# Altium schematic sheet Schematics_2000W.SchDoc
size A4; SheetNumber: 1; SheetTotal: 1; SPICEModelCacheILTZOTXN: <root> / <DocumentId>ILTZOTXN</DocumentId> / <CacheFrame Number="0"> / <Model Name="transil" Kind="CKT"> / <Text>* File     : P6KE.LIB / * Revision : 1.0 / * Date     : June 2011 / * / *************************************************************************************** / * Information included is believed to be accurate and reliable. However, * / * ST Microelectronics assumes no responsibility for the consequences of  * / * use of such information nor for any infringement of patents or other   * / * rights of third parties which may result from its use. No license is   * / * granted by implication or otherwise under any patent patent rights of  * / * ST Microelectronics. Specification mentionned in this publication are  * / * subject to change without notice. This publication superseedes and 	 * / * replaces all information previously supplied. ST Microelectronics      * / * products are not authorized for use as critical components in life     * / * support or systems without express written approval of ST              * / * Microelectronics.                          	                         * / *                                                                    	 *			* / *    (c) 1997 ST Microelectronics. All rights reserved.     	         * / *                                                                    	 *			* / *           ST Microelectronics GROUP OF COMPANIES                       * / * Australia - Brazil - France - Germany - Hong Kong - Italy - Japan  	 * / * Korea - Malaysia - Malta - Morocco - The Netherlands - Singapore   	 * / * Spain - Sweden - Switzerland - Taiwan - United Kingdom - U.S.A.    	 * / *									 * / *************************************************************************************** / * / * UNIDIRECTIONAL TRANSIL / *$ / .SUBCKT TRANSIL  Anode  Cathode  PARAMS: / + IRM=1u VBRnom=12  VBRmax=13  IR=1m / + VCLmax=20  Ipp=100  Cjof=1n / + ISF=1f  NF=1  RSF=1m  IKFF=1000 / * IRM		Stand-off current at VRM / * VBR		Breakdown voltage / * IR		Reverse current at VBR / * VCL		Clamping voltage / * Ipp		Surge current / * Cjo		junction capacitance at 0V / * IS		Saturation current / * N		Emission coefficient / * RS		Serie résistance / * IKF		High injection knee current / Drev    A_int    Cathode    TRANSR / Dfwd   Anode   Cathode    TRANSF / Dr       A_int    Anode       DTRANS / ***** REVERSE BEHAVIOUR ***** / .MODEL  TRANSR  D( / + IS={IRM/2}   RS={(VCLmax-VBRmax)/Ipp} / + BV={VBRnom}  IBV={IR} / + IKF=1000  Cjo=1p  M=.3333  VJ=.6 / + ISR=1n  TT=1u ) / ****************** FORWARD BEHAVIOUR ****************** / ***** JUNCTION CAPACITANCE BEHAVIOUR Cj(VR) ***** / .MODEL   TRANSF  D( / + IS={ISF}  N={NF}  RS={RSF}  IKF={IKFF} / + Cjo={Cjof}  M=.3333  VJ=0.6  ISR=1.000E-21 / + BV=1000  IBV=1n  TT=1u ) / .MODEL   DTRANS  D( / + IS=1n  N=.01  RS=1u  IKF=1000  Cjo=1p / + M=.3333  VJ=.6  ISR=1n  BV=1000  IBV=1u / + TT=1u ) / .ENDS</Text> / </Model> / <Model Name="p6ke6v8a" Kind="CKT"> / <Text>************************************************************************************************* / *				P6KE FAMILY					* / ************************************************************************************************* / *$ / .SUBCKT  P6KE6V8A  Anode  Cathode / X1  Anode  Cathode  TRANSIL  PARAMS: / + IRM=1m  VBRnom=6.8  VBRmax=7.14 / + IR=10m  VCLmax=13.4  Ipp=298  Cjof=4000p / + ISF=27.04f   NF=1.016  RSF=13.69m   IKFF=41.7 / .ENDS</Text> / <Dependency>0\transil</Dependency> / </Model> / <Model Name="1n5822rl" Kind="MDL"> / <Text>******************************************************************* / * Model name       : 1N5822RL / * Description      : Low Drop Power Schottky Diode / * Package type     : DO-201AD / ******************************************************************* / .MODEL 1N5822RL D IS=2.5069E-6 N=1.0281 RS=11.149E-3 IKF=403.32 CJO=980.33E-12 / + M=.47978 VJ=.3905 ISR=5.2260E-6 NR=4.9950 EG=.69 XTI=2 TT=0 FC=0.5</Text> / </Model> / <Model Name="irf1407" Kind="CKT"> / <Text>.SUBCKT irf1407 1 2 3 / ************************************** / *      Model Generated by MODPEX     * / *Copyright(c) Symmetry Design Systems* / *         All Rights Reserved        * / *    UNPUBLISHED LICENSED SOFTWARE   * / *   Contains Proprietary Information * / *      Which is The Property of      * / *     SYMMETRY OR ITS LICENSORS      * / *Commercial Use or Resale Restricted * / *   by Symmetry License Agreement    * / ************************************** / * Model generated on Jan 15, 03 / * MODEL FORMAT: SPICE3 / * Symmetry POWER MOS Model (Version 1.0) / * External Node Designations / * Node 1 -&gt; Drain / * Node 2 -&gt; Gate / * Node 3 -&gt; Source / M1 9 7 8 8 MM L=100u W=100u / .MODEL MM NMOS LEVEL=1 IS=1e-32 / +VTO=3.91946 LAMBDA=0 KP=331.363 / +CGSO=5.53647e-05 CGDO=1e-11 / RS 8 3 0.00443748 / D1 3 1 MD / .MODEL MD D IS=1.96051e-09 RS=0.00257891 N=1.34027 BV=75 / +IBV=0.00025 EG=1.2 XTI=2.26834 TT=0.0001 / +CJO=3.026e-09 VJ=4.99086 M=0.799307 FC=0.5 / RDS 3 1 1e+06 / RD 9 1 0.00208794 / RG 2 7 4.94006 / D2 4 5 MD1 / * Default values used in MD1: / *   RS=0 EG=1.11 XTI=3.0 TT=0 / *   BV=infinite IBV=1mA / .MODEL MD1 D IS=1e-32 N=50 / +CJO=7.6815e-09 VJ=0.5 M=0.9 FC=1e-08 / D3 0 5 MD2 / * Default values used in MD2: / *   EG=1.11 XTI=3.0 TT=0 CJO=0 / *   BV=infinite IBV=1mA / .MODEL MD2 D IS=1e-10 N=0.4 RS=3e-06 / RL 5 10 1 / FI2 7 9 VFI2 -1 / VFI2 4 0 0 / EV16 10 0 9 7 1 / CAP 11 10 9.06553e-09 / FI1 7 9 VFI1 -1 / VFI1 11 6 0 / RCAP 6 10 1 / D4 0 6 MD3 / * Default values used in MD3: / *   EG=1.11 XTI=3.0 TT=0 CJO=0 / *   RS=0 BV=infinite IBV=1mA / .MODEL MD3 D IS=1e-10 N=0.4 / .ENDS irf1407</Text> / </Model> / </CacheFrame> / </root>
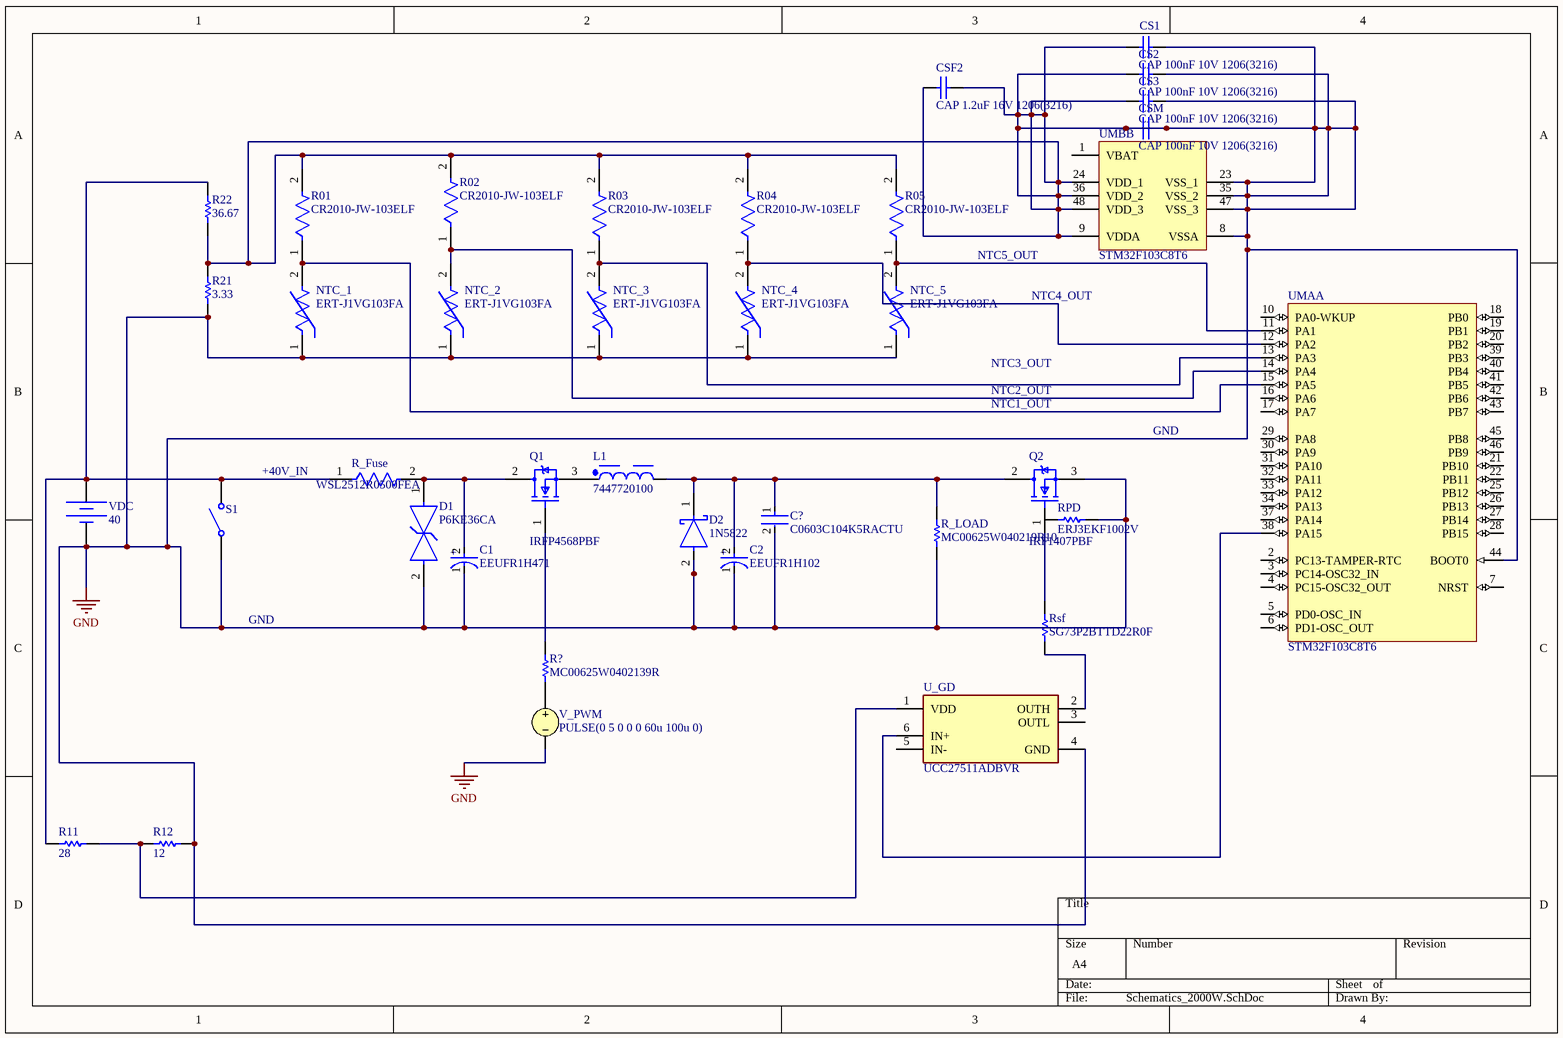
[diagram p0: Schematics_2000W.SchDoc]

## Parts
C1  EEUFR1H471  [FP-RAD-TH-D_12_5_0_5-L_20-MFG]
C2  EEUFR1H102  [FP-RAD-TH-D_16_0_5-L_25_2-MFG]
C?  C0603C104K5RACTU  [FP-C0603C-CF-MFG]
CS1  CAP 100nF 10V 1206(3216)  [CAPC1206(3216)100_M]
CS2  CAP 100nF 10V 1206(3216)  [CAPC1206(3216)100_M]
CS3  CAP 100nF 10V 1206(3216)  [CAPC1206(3216)100_M]
CSF2  CAP 1.2uF 16V 1206(3216)  [CAPC1206(3216)110_N]
CSM  CAP 100nF 10V 1206(3216)  [CAPC1206(3216)100_M]
D1  P6KE36CA  [FP-17-02-CA-MFG]
D2  1N5822  [FP-DO-201AD-MFG]
L1  7447720100  [WE-TI_8095]
NTC_1  ERT-J1VG103FA  [FP-ERTJ1-MFG]
NTC_2  ERT-J1VG103FA  [FP-ERTJ1-MFG]
NTC_3  ERT-J1VG103FA  [FP-ERTJ1-MFG]
NTC_4  ERT-J1VG103FA  [FP-ERTJ1-MFG]
NTC_5  ERT-J1VG103FA  [FP-ERTJ1-MFG]
Q1  IRFP4568PBF  [FP-PG-TO247-3-MFG]
Q2  IRF1407PBF  [FP-PG-TO220-3-MFG]
R01  CR2010-JW-103ELF  [FP-CR2010-IPC_C]
R02  CR2010-JW-103ELF  [FP-CR2010-IPC_C]
R03  CR2010-JW-103ELF  [FP-CR2010-IPC_C]
R04  CR2010-JW-103ELF  [FP-CR2010-IPC_C]
R05  CR2010-JW-103ELF  [FP-CR2010-IPC_C]
R11  value 28  (hidden comment: Resistor)
R12  value 12  (hidden comment: Resistor)
R21  value 3.33  (hidden comment: Resistor)
R22  value 36.67  (hidden comment: Resistor)
R?  MC00625W0402139R  [RESC1005X40X25ML10T10]
R_Fuse  WSL2512R0500FEA  [FP-WSL2512-MFG]
R_LOAD  MC00625W040219R10  [RESC1005X40X25NL10T10]
RPD  ERJ3EKF1002V  [RESC1609X55X30LL15T15]
Rsf  SG73P2BTTD22R0F  [RESC3216X70X40NL20T20]
S1  Single-Pole, Single-Throw Switch  (value not drawn)
U_GD  UCC27511ADBVR  [FP-DBV0006A-IPC_B]
UMA  STM32F103C8T6  [STM-LQFP48_L]  (part A of 2)
UMB  STM32F103C8T6  [STM-LQFP48_L]  (part B of 2)
V_PWM  PULSE(0 5 0 0 0 60u 100u 0)
VDC  DC Magnitude: 40  (hidden comment: Constant Voltage Source)

## Nets
GND: C1.1(C) C2.1(C) C?.2 CS1.1 CS1.2 CS2.1 CS2.2 CS3.1 CS3.2 CSF2.1 CSF2.2 CSM.1 CSM.2 D1.2 D2.2(A) NTC_1.1 NTC_2.1 NTC_3.1 NTC_4.1 NTC_5.1 Q2.3(S) R01.2 R02.2 R03.2 R04.2 R05.2 R12.2 R21.1 R21.2 R22.1 R_LOAD.1 RPD.2 S1.1 U_GD.4(GND) UMA.44(BOOT0) UMB.8(VSSA) UMB.9(VDDA) UMB.23(VSS_1) UMB.24(VDD_1) UMB.35(VSS_2) UMB.36(VDD_2) UMB.47(VSS_3) UMB.48(VDD_3) V_PWM.2 VDC.2
NetC1_2: C1.2(A) D1.1 Q1.2(D) R_Fuse.2
NetC2_2: C2.2(A) C?.1 D2.1(C) L1.2 Q2.2(D) R_LOAD.2
NetL1_1: L1.1 Q1.3(S)
NetNTC_1_2: NTC_1.2 R01.1 UMA.15(PA5)
NetNTC_2_2: NTC_2.2 R02.1 UMA.14(PA4)
NetNTC_3_2: NTC_3.2 R03.1 UMA.13(PA3)
NetNTC_4_2: NTC_4.2 R04.1 UMA.12(PA2)
NetNTC_5_2: NTC_5.2 R05.1 UMA.11(PA1)
NetQ1_1: Q1.1(G) R?.2
NetQ2_1: Q2.1(G) Rsf.2
NetR11_1: R11.1 R22.2 R_Fuse.1 S1.2 VDC.1
NetR11_2: R11.2 R12.1 U_GD.1(VDD)
NetR?_1: R?.1 V_PWM.1
NetRsf_1: Rsf.1 U_GD.2(OUTH)
NetU_GD_6: U_GD.6(IN+) UMA.38(PA15)

Not connected (* = marked no-connect by the designer): RPD 1; U_GD 3(OUTL) 5(IN-); UMA 2(PC13-TAMPER-RTC) 3(PC14-OSC32_IN) 4(PC15-OSC32_OUT) 5(PD0-OSC_IN) 6(PD1-OSC_OUT) 7(NRST) 10(PA0-WKUP) 16(PA6) 17(PA7) 18(PB0) 19(PB1) 20(PB2) 21(PB10) 22(PB11) 25(PB12) 26(PB13) 27(PB14) 28(PB15) 29(PA8) 30(PA9) 31(PA10) 32(PA11) 33(PA12) 34(PA13) 37(PA14) 39(PB3) 40(PB4) 41(PB5) 42(PB6) 43(PB7) 45(PB8) 46(PB9); UMB 1(VBAT)

## Notes on the sheet
- NTC5_OUT
- NTC4_OUT
- NTC3_OUT
- NTC2_OUT
- NTC1_OUT
- GND
- +40V_IN
- (in symbol CMP-05427-000625-1) +
- (in symbol CMP-05427-001062-1) +

## Library data of the parts
C1 = CMP-05427-001062-1: Aluminum Electrolytic Capacitors (Radial Lead Type) 470uF ±20% 50V; Ripple Current: 2.26A; Lead/Base Style: Straight; Lead Diameter: 0.6mm; Life (Hours): 10000Hour; Impedance: 22mR; Voltage Rating: 50V; RoHS Compliant: Yes; Max Operating Temperature: 105°C; Length: 20mm; Packaging: Bulk; Capacitance: 470uF; Height: 20mm; Ripple Current (AC): 2.26A; Lead Pitch: 5mm; Voltage: 50V; Termination: Radial; Tolerance: 20%; Lead Free: Lead Free; Case/Package: Radial; Series: FR; Features: General Purpose; Mount: Through Hole; Height - Seated (Max): 0.787inch; Construction: RADIAL; Package Quantity: 200; Number of Pins: 2; ESR (Equivalent Series Resistance): 22mR; Voltage Rating (DC): 50V; Radiation Hardening: No; Diameter: 12.5mm; Min Operating Temperature: -40°C; Value: 470uF
C2 = CMP-05427-000625-1: Aluminum Electrolytic Capacitors (Radial Lead Type) 1000uF ±20% 50V; Polarity: Polar; ESR (Equivalent Series Resistance): 16mR; Ripple Current: 3.32A; Life (Hours): 10000Hour; Lead Diameter: 0.8mm; Dielectric Material: Aluminium; Lead/Base Style: Straight; Capacitance: 1mF; Value: 1mF; RoHS Compliant: Yes; Mount: Through Hole; Voltage Rating: 50V; Lead Free: Lead Free; Packaging: Bulk; Min Operating Temperature: -40°C; Package Quantity: 100; Max Operating Temperature: 105°C; Radiation Hardening: No; Termination: Radial; Construction: RADIAL; Height: 25mm; Length: 25mm; Tolerance: 20%; Number of Pins: 2; Ripple Current (AC): 3.32A; Diameter: 16mm; Case/Package: Radial; Impedance: 16mR; Height - Seated (Max): 1.063inch; Voltage: 50V; Voltage Rating (DC): 50V; Series: FR; Lead Pitch: 7.5mm
C? = CMP-2006-03061-2: CAP CER 0.1UF 50V X7R 0603; Manufacturer: KEMET; Tolerance: 0.1; Description: C0603 0.10 μF X7R 30ppm/°C 10.00% 50 V; Temperature Coefficient: 30ppm/°C; Material: Ceramic; Automotive Grade: Grade 1; Value: 0.10 μF; Temperature: -55°C to +125°C; RoHS: TRUE; Temperature Range High: +125°C; Lead Free: Yes; Octopart: https://octopart.com/c0603c104k5ractu-kemet-139244; Digikey Description: CAP CER 0.1UF 50V X7R 0603; Category: Cap; Package: C0603C-CF; ComponentLink2Description: Datasheet; Temperature Range Low: -55°C; Device Class L1: Passive Components; Voltage Rating: 50 V; Automotive: Yes; Device Class L3: Ceramic Capacitors; ComponentLink2URL: https://api.kemet.com/component-edge/download/datasheet/C0603C100J5GACAUTO.pdf; Capacitance: 0.10 μF; Device Class L2: Capacitors; Manufacturer Part Number: C0603C104K5RACTU; Temperature Characteristic: X7R; Height: 0.87mm
CS1-CS3 CSM = CMP-1037-04172-1: CAP 100nF 10V ±5% 1206 (3216 Metric) Thickness 1mm SMD; Case-Metric: 3216; Case-EIA: 1206; Tolerance: Â±5%; Max Thickness: 1 mm; Rated Voltage: 10 V; Technology: SMT; Value: 100nF
CSF2 = CMP-1037-04737-1: CAP 1.2uF 16V ±10% 1206 (3216 Metric) Thickness 1.1mm SMD; Tolerance: Â±10%; Case-EIA: 1206; Case-Metric: 3216; Technology: SMT; Max Thickness: 1.1 mm; Rated Voltage: 16 V; Value: 1.2uF
D1 = CMP-00278-84409643-1: P6KE36CA Fairchild P6KE36CA, Bi-Directional TVS Diode, 600W, 2-Pin DO-15; Power Line Protection: No; Reverse Standoff Voltage: 30.8V; Leakage Current: 5µA; Peak Pulse Current: 12A; Max Breakdown Voltage: 37.8V; Number of Channels: 1; Capacitance: 1.6pF; Clamping Voltage: 49.9V; Polarity: Bidirectional; Voltage Rating (DC): 36V; Breakdown Voltage: 34.2V; Max Junction Temperature (Tj): 175°C; Element Configuration: Single; Test Current: 1mA; Max Power Dissipation: 600W; Lead Free: Lead Free; Radiation Hardening: No; Termination: Axial; Case/Package: Axial; Width: 3.56mm; Length: 7.62mm; Weight: 300mg; REACH SVHC: No SVHC; Max Reverse Leakage Current: 5µA; Power Rating: 600W; Direction: Bidirectional; Max Surge Current: 12A; Diameter: 3.56mm; Peak Pulse Power: 600W; Max Operating Temperature: 175°C; RoHS: Compliant; Mount: Through Hole; Number of Pins: 2; Number of Bidirectional Channels: 1; Min Breakdown Voltage: 34.2V; Reverse Breakdown Voltage: 34.2V; Composition: Zener; Number of Elements: 1; Min Operating Temperature: -55°C; Operating Supply Voltage: 30.8V; Height: 3.68mm; NexarPartId: 84409643
D2 = CMP-12187-000025-1: DIODE SCHOTTKY 40V 3A DO201AD; Manufacturer: STMicroelectronics; Max Junction Temp: +150°C; Peak Reverse Current: 2mA; Max Surge Forward Current: 80A; Temperature Range High: +150°C; Automotive: No; RoHS: TRUE; ComponentLink2Description: Datasheet; Manufacturer Part Number: 1N5822; Lead Free: Yes; Octopart: https://octopart.com/1n5822-stmicroelectronics-323225; Device Class L2: Diodes; Max Repetitive Reverse Voltage: 40V; Height: 5.3mm; Category: Diode; Digikey Description: DIODE SCHOTTKY 40V 3A DO201AD; ComponentLink2URL: https://www.st.com/resource/en/datasheet/1n5822.pdf; Device Class L3: Schottky Diodes; Device Class L1: Discrete Semiconductors; Forward Current: 3A; Mouser Description: Schottky Diodes & Rectifiers Vr/40V Io/3A BULK; Package: DO-201AD
L1 = CMP-03913-110288125-2: 7447720100 Inductor, 10Uh, Unshielded, 3.5A, Rad Rohs Compliant: Yes; Inductance: 10µH; DC Resistance (DCR): 30mΩ; Voltage Rating: 80V; NexarPartId: 110288125; Ambient Temperature Range Low: -40°C; Ambient Temperature Range High: 85°C; Width: 7.8mm; Height: 9.5mm; RoHS: Compliant; Length: 7.8mm; Min Operating Temperature: -40°C; Current Rating: 3.5A; Max Operating Temperature: 125°C
NTC_1-NTC_5 = CMP-05419-000001-1: THERMISTOR NTC 10KOHM 3380K 0603; Resistance: 10kR; Max Power Dissipation: 100mW; Resistance Tolerance: 1%; Case Code (Imperial): 0603; Height: 0.8mm; Case/Package: 0603; Depth: 0.8mm; Min Operating Temperature: -40°C; Accuracy: 1%; Series: ERT-J; Termination: SMD/SMT; Length: 1.6mm; Number of Pins: 2; Lead Free: Lead Free; Power Rating: 100mW; Package Quantity: 4000; RoHS Compliant: Yes; Max Operating Temperature: 125°C; Width: 800um; REACH SVHC: No SVHC; Packaging: Tape and Reel; Tolerance: 1%; Mount: Surface Mount; Case Code (Metric): 1608; Radiation Hardening: No
Q1 = CMP-32901-000093-1: MOSFET N-CH 150V 171A TO-247AC; Manufacturer: Infineon; Power Dissipation: 517W; Reverse Recovery Time: 110ns; Gate Charge At Vgs: 151nC @ 10V; Number Of Channels: 1; Pulse Drain Current: 684A; Standoff Height: 3.71mm; Turn On Delay Time: 27ns; Max Forward Diode Voltage: 1.3V; Turn Off Delay Time: 47ns; Depletion Mode: False; Threshold Vgs Max: 5V; Input Capacitace At Vds: 10470pF @ 50V; Reverse Recovery Charge: 515nC; Rthja Max: 40°C/W; Drain To Source Resistance: 4.8mΩ; Threshold Vgs Min: 3V; Max Junction Temp: +175°C; Gate To Source Voltage: 30V; Temperature: -55°C to +175°C; Device Class L1: Discrete Semiconductors; Octopart: https://octopart.com/irfp4568pbf-infineon-65874045; Manufacturer Part Number: IRFP4568PBF; Temperature Range Low: -55°C; Category: Trans; ComponentLink2URL: https://www.infineon.com/dgdl/irfp4568pbf.pdf?fileId=5546d462533600a40153562c7c32201b; ComponentLink2Description: Datasheet; Height: 24.99mm; Drain To Source Breakdown Voltage: 150V; Number Of N Channels: 1; Automotive: No; Lead Free: Yes; Device Class L3: MOSFETs; Package: PG-TO247-3; Drain To Source Voltage: 150V; Device Class L2: Transistors; Footprint Url: https://www.infineon.com/cms/en/product/packages/PG-TO247/PG-TO247-3-901/; Continuous Drain Current: 171A; Digikey Description: MOSFET N-CH 150V 171A TO-247AC; RoHS: TRUE; Temperature Range High: +175°C
Q2 = CMP-32901-000505-1: MOSFET N-CH 75V 130A TO-220AB; Rds On Max: 7.8mR; Element Configuration: Single; Max Power Dissipation: 330W; Turn-Off Delay Time: 150ns; Input Capacitance: 5.6nF; Gate to Source Voltage (Vgs): 20V; Turn-On Delay Time: 11ns; Threshold Voltage: 4V; Max Operating Temperature: 175°C; Height: 0.65inch; RoHS Compliant: Yes; Case/Package: TO-220; Lead Free: Lead Free; Max Dual Supply Voltage: 75V; Drain to Source Voltage (Vdss): 75V; Min Operating Temperature: -55°C; Halogen Free: Halogen Free; REACH SVHC: No SVHC; Length: 0.42inch; Power Dissipation: 330W; Drain to Source Resistance: 7.8mR; Packaging: Rail/Tube; Continuous Drain Current (ID): 130A; Number of Pins: 3; Width: 0.19inch; Drain to Source Breakdown Voltage: 75V; Mount: Through Hole
R01 R02 R03 R04 R05 = CMP-07231-003456-1: Thick Film Chip Resistors 2010 10kΩ 0.5W 5% 200ppm/°C; Resistance: 10kR; Voltage Rating: 200V; Power Rating: 500mW; Tolerance: 5%; Contact Plating: Tin; Length: 5mm; Case/Package: 2010; Package Quantity: 4000; Max Operating Temperature: 155°C; Case Code (Imperial): 2010; Mount: Surface Mount; Case Code (Metric): 5025; Width: 2.5mm; Temperature Coefficient: 200ppm/°C; Packaging: Tape and Reel; Height: 0.6mm; Radiation Hardening: No; Composition: Thick Film; Min Operating Temperature: -55°C; Termination: SMD/SMT
R11 R12 R21 R22 = Resistor: TC1: 0; SimulationGenericComponent: True; TC2: 0
R? = CMP-2002-06169-1: Manufacturer: Multicomp; Part Number: MC00625W0402139R
R_Fuse = CMP-2000-07420-2: RES 0.05 OHM 1% 1W 2512; Manufacturer: Vishay; 3DS Part Number: 110-00001; Resistance: 50mΩ; Temperature Coefficient: 75ppm/°C; Automotive Grade: Grade 0; Description: Power Metal Strip® Resistors, Low Value (down to 0.0005 ), Surface Mount; Value: 50mΩ; Automotive: Yes; Tolerance: 1%; Device Class L3: Chip SMD Resistors; Category: Res; Package: WSL2512; Lead Free: Yes; Octopart: https://octopart.com/wsl2512r0500fea-vishay-39744678; ComponentLink2URL: http://www.vishay.com/docs/30100/wsl.pdf; Height: 0.889mm; Composition: Metal Element; Temperature Range High: +170°C; ComponentLink2Description: Datasheet; Digikey Description: RES 0.05 OHM 1% 1W 2512; Series: WSL; Temperature: -65°C to +170°C; Temperature Range Low: -65°C; Manufacturer Part Number: WSL2512R0500FEA; Device Class L1: Passive Components; RoHS: TRUE; Power Rating: 1W; Ipc Land Pattern Name: RESC635318X64; Device Class L2: Resistors
R_LOAD = CMP-2002-06389-1: Manufacturer: Multicomp; Part Number: MC00625W040219R10
RPD = CMP-1012-00623-3: Chip Resistor, 10 KOhm, +/- 1%, 0.1 W, -55 to 155 degC, 0603 (1608 Metric), RoHS, Tape and Reel; Manufacturer: Panasonic; Voltage Rating: 75V; Case\/Package: 0603; Power Rating: 100mW; Resistance: 10KOhm; Temperature Coefficient: 100ppm\/degreesC; Value: 10KOhm; Number of Pins: 2; Package Reference: 603; Depth: 0.8mm; Mount: SurfaceMount; Package Description: 2-Pin Surface Mount Device, Body 1.6 x 0.85 mm; Datasheet Version: 02/2017; Length: 1.6mm; Lead Free: LeadFree; Height: 0.45mm; Number of Terminations: 2; Max Power Dissipation: 100mW; Min Operating Temperature: -55degC; Datasheet URL: https://industrial.panasonic.com/cdbs/www-data/pdf/RDA0000/AOA0000C304.pdf; Termination: SMD/SMT; Case Code (Metric): 1608; Case Code (Imperial): 0603; Tolerance: 1%; Max Operating Temperature: 155degC; RoHSCompliant: true; Voltage Rating (DC): 75V; Radiation Hardening: No; Packaging: TapeandReel; Composition: ThickFilm; Mounting Technology: SurfaceMount; Manufacturer URL: http://www.panasonic.com/; Width: 0.031inch; REACH SVHC: NoSVHC; Contact Plating: Tin; Military Standard: Not; Package Quantity: 1
Rsf = CMP-2003-01707-1: Manufacturer: KOA Speer; Part Number: SG73P2BTTD22R0F
S1 = SPST SW: closed: 0; Rclosed: 1m; Ropen: 1Meg; SimulationGenericComponent: True
U_GD = CMP-04912-000035-1: IC GATE DRVR LOW-SIDE SOT23-6; Number of Drivers: 1; Max Output Current: 8A; Channel Type: Single; Case/Package: SOT-23-6; Mount: Surface Mount; Max Operating Temperature: 140°C; Packaging: Tape and Reel; Min Operating Temperature: -40°C; RoHS Compliant: Yes; Number of Channels: 1
UMA UMB = CMP-0237-00215-3: ARM Cortex-M3 32-bit MCU, 64 KB Flash, 20 KB Internal RAM, 37 I/Os, 48-pin LQFP, -40 to 85 degC, Tray; Supply Voltage(Vcc) min (V): 2; Internal RAM Size (kB): 20; FLASH Size (Prog) (kB): 64; A/D Converter: 2x12-bit (10 Channel); I/Os (High Current): 37; Operating Frequency(F) (Processor speed) (MHz): 72; Core: ARM Cortex-M3; ComponentLink3Description: Package Specification; Mounting Technology: Surface Mount; PartNumber: STM32F103C8T6; PackageReference: LQFP48; Packing: Tray; ComponentLink3URL: http://www.st.com/st-web-ui/static/active/en/resource/technical/document/datasheet/DM00058181.pdf; DatasheetVersion: Rev. 16; ComponentLink1URL: http://www.st.com/web/en/home.html; PackageVersion: Rev. 6, 06/2013; ComponentLink2URL: http://www.st.com/st-web-ui/static/active/en/resource/technical/document/datasheet/CD00161566.pdf; ComponentLink1Description: Manufacturer URL; ComponentLink2Description: Datasheet; PackageDescription: 48-Pin Low Profile Quad Flat Package, 7 x 7 mm Body, 0.5 mm Pitch
V_PWM = VSRC: Voltage Source; Note: PCB Footprint - Not required; AC Magnitude: 1; AC Phase: 0; DC Magnitude: 10; Pulsed Value: 5; Published: 8-Jun-2000; LatestRevisionDate: 17-Jul-2002; LatestRevisionNote: Re-released for DXP Platform.; PackageReference: Not Applicable; Publisher: Altium Limited; Initial Value: 0; Time Delay: 0; Rise Time: 0; Fall Time: 0; Pulse Width: 60u; Period: 100u; Phase: 0
VDC = Battery: SimulationGenericComponent: True